# EAGLE schematic Shield_Engino (EAGLE 9.6.2)
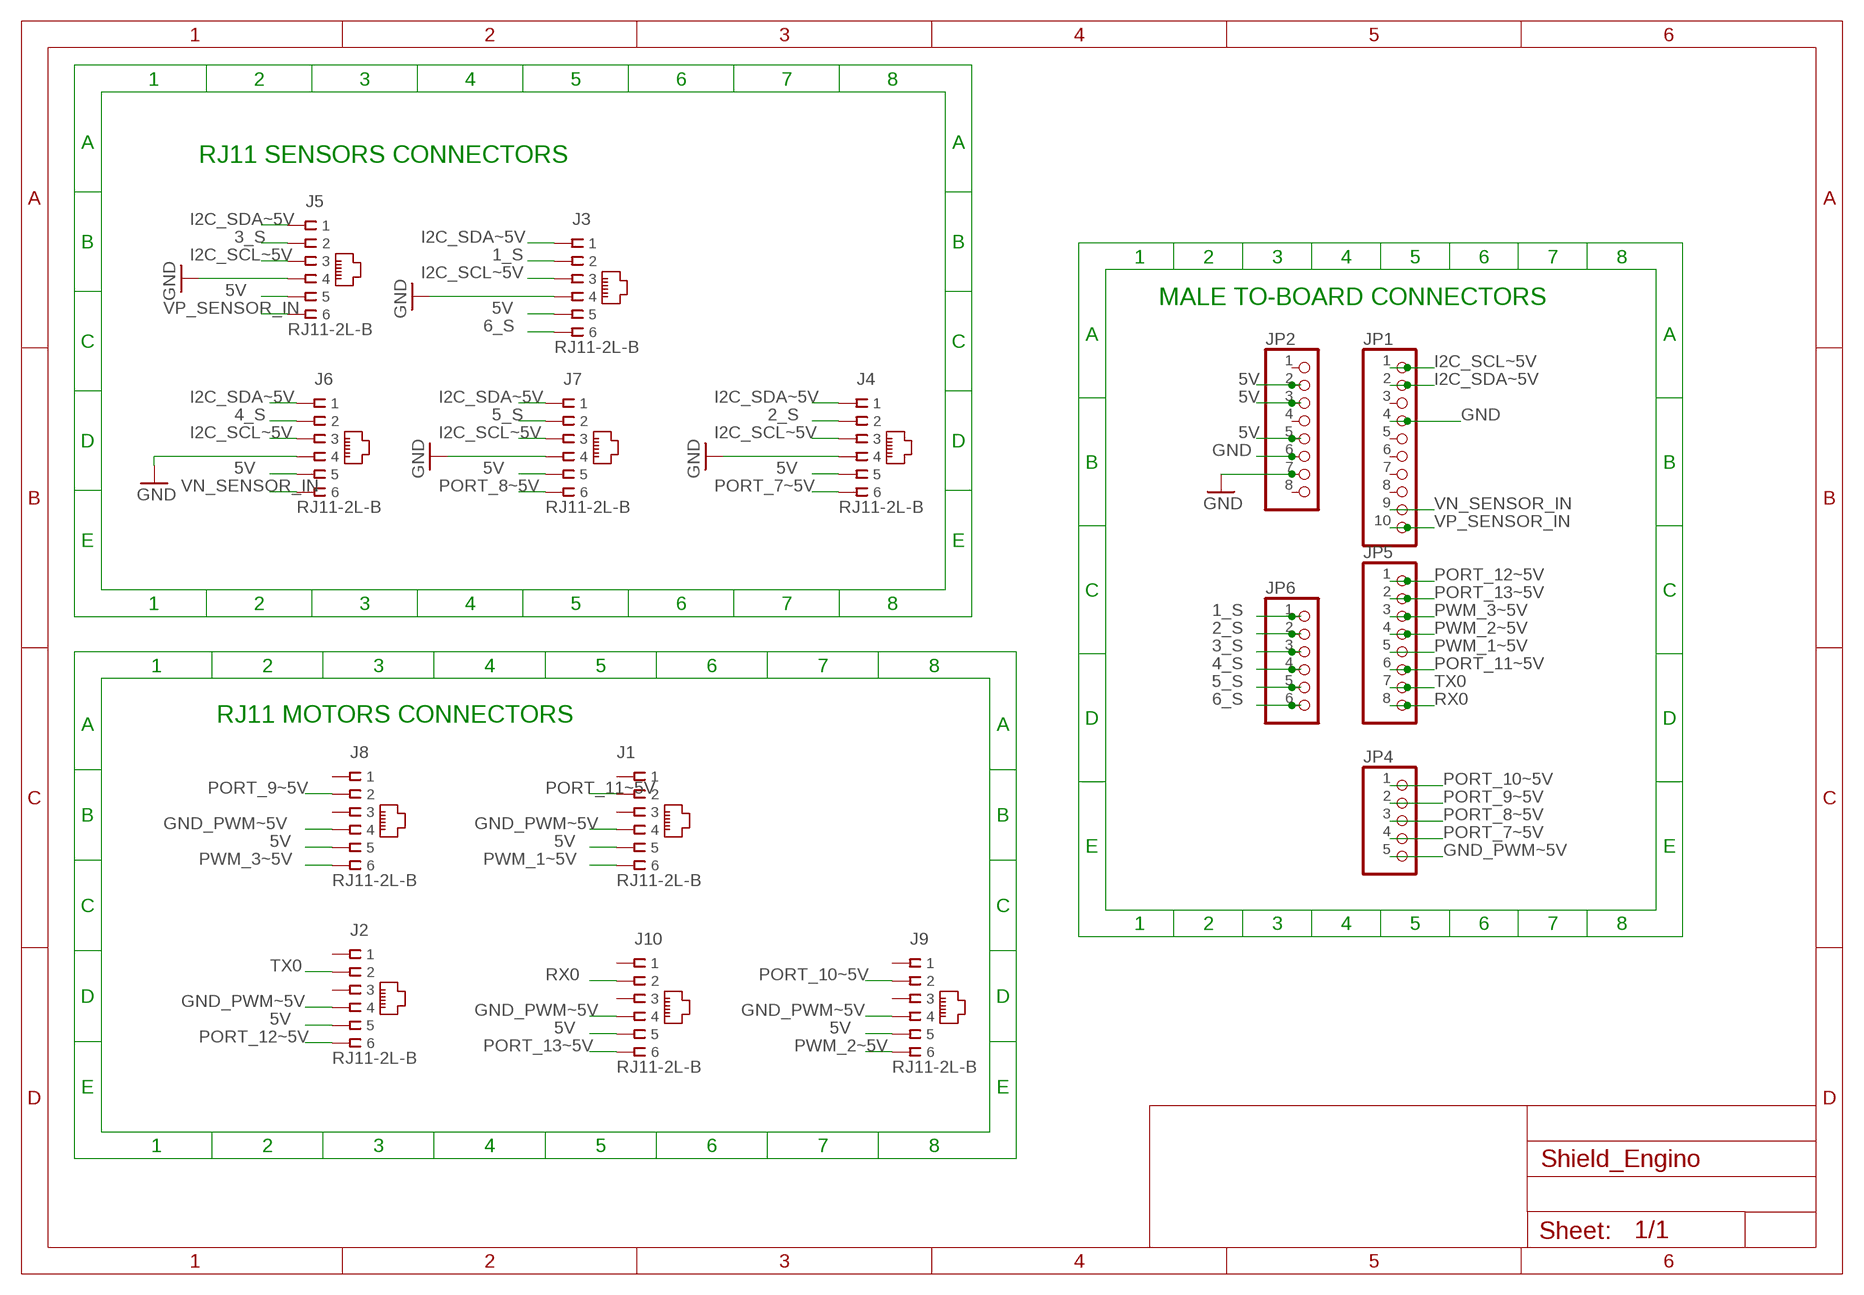
[diagram p0: schematic, sheet 1]

## Parts
J1  RJ11-2L-B  [RJ11-NO_SHIELD]
J2  RJ11-2L-B  [RJ11-NO_SHIELD]
J3  RJ11-2L-B  [RJ11-NO_SHIELD]
J4  RJ11-2L-B  [RJ11-NO_SHIELD]
J5  RJ11-2L-B  [RJ11-NO_SHIELD]
J6  RJ11-2L-B  [RJ11-NO_SHIELD]
J7  RJ11-2L-B  [RJ11-NO_SHIELD]
J8  RJ11-2L-B  [RJ11-NO_SHIELD]
J9  RJ11-2L-B  [RJ11-NO_SHIELD]
J10  RJ11-2L-B  [RJ11-NO_SHIELD]
JP1  PINHD-1X10_2.54-SMD  [1X10SMD]
JP2  PINHD-1X8_2.54-SMD  [1X08SMD]
JP4  PINHD-1X5_2.54-SMD  [1X05SMD]
JP5  PINHD-1X8_2.54-SMD  [1X08SMD]
JP6  PINHD-1X6_2.54-SMD  [1X06SMD]

## Nets
1_S: J3.2 JP6.1
2_S: J4.2 JP6.2
3_S: J5.2 JP6.3
4_S: J6.2 JP6.4
5_S: J7.2 JP6.5
5V: J1.5 J2.5 J3.5 J4.5 J5.5 J6.5 J7.5 J8.5 J9.5 J10.5 JP2.2 JP2.3 JP2.5
6_S: J3.6 JP6.6
GND: J3.4 J4.4 J5.4 J6.4 J7.4 JP1.4 JP2.6 JP2.7
GND_PWM~5V: J1.4 J2.4 J8.4 J9.4 J10.4 JP4.5
I2C_SCL~5V: J3.3 J4.3 J5.3 J6.3 J7.3 JP1.1
I2C_SDA~5V: J3.1 J4.1 J5.1 J6.1 J7.1 JP1.2
PORT_7~5V: J4.6 JP4.4
PORT_8~5V: J7.6 JP4.3
PORT_9~5V: J8.2 JP4.2
PORT_10~5V: J9.2 JP4.1
PORT_11~5V: J1.2 JP5.6
PORT_12~5V: J2.6 JP5.1
PORT_13~5V: J10.6 JP5.2
PWM_1~5V: J1.6 JP5.5
PWM_2~5V: J9.6 JP5.4
PWM_3~5V: J8.6 JP5.3
RX0: J10.2 JP5.8
TX0: J2.2 JP5.7
VN_SENSOR_IN: J6.6 JP1.9
VP_SENSOR_IN: J5.6 JP1.10
Unconnected: J1.1 J1.3 J2.1 J2.3 J8.1 J8.3 J9.1 J9.3 J10.1 J10.3 JP1.3 JP1.5 JP1.6 JP1.7 JP1.8 JP2.1 JP2.4 JP2.8

## Notes on the sheet
- RJ11 SENSORS CONNECTORS
- MALE TO-BOARD CONNECTORS
- RJ11 MOTORS CONNECTORS

## Library data of the parts
J1-J10 = con-tycoelectronics:RJ11: CORCOM Modular RJ Jacks No Shield Source: www.tycoelectronics.com .. ENG_DS_1654001_1099_RJ_L_0507.pdf; MF: TYCO ELECTRONICS; MPN: RJ11-2L-B; OC_FARNELL: unknown; OC_NEWARK: 83F4463
JP1 = pinhead-1:PINHD-1X10: PIN HEADER
JP2 JP5 = pinhead-1:PINHD-1X8: PIN HEADER
JP4 = pinhead-1:PINHD-1X5: PIN HEADER
JP6 = pinhead-1:PINHD-1X6: PIN HEADER

## Net classes
0 default: width 0.813 mm, drill 0.6 mm